# Altium schematic sheet leo_power_sch.SchDoc
size 350 x 260 mm; SheetNumber: 1; SheetTotal: 6
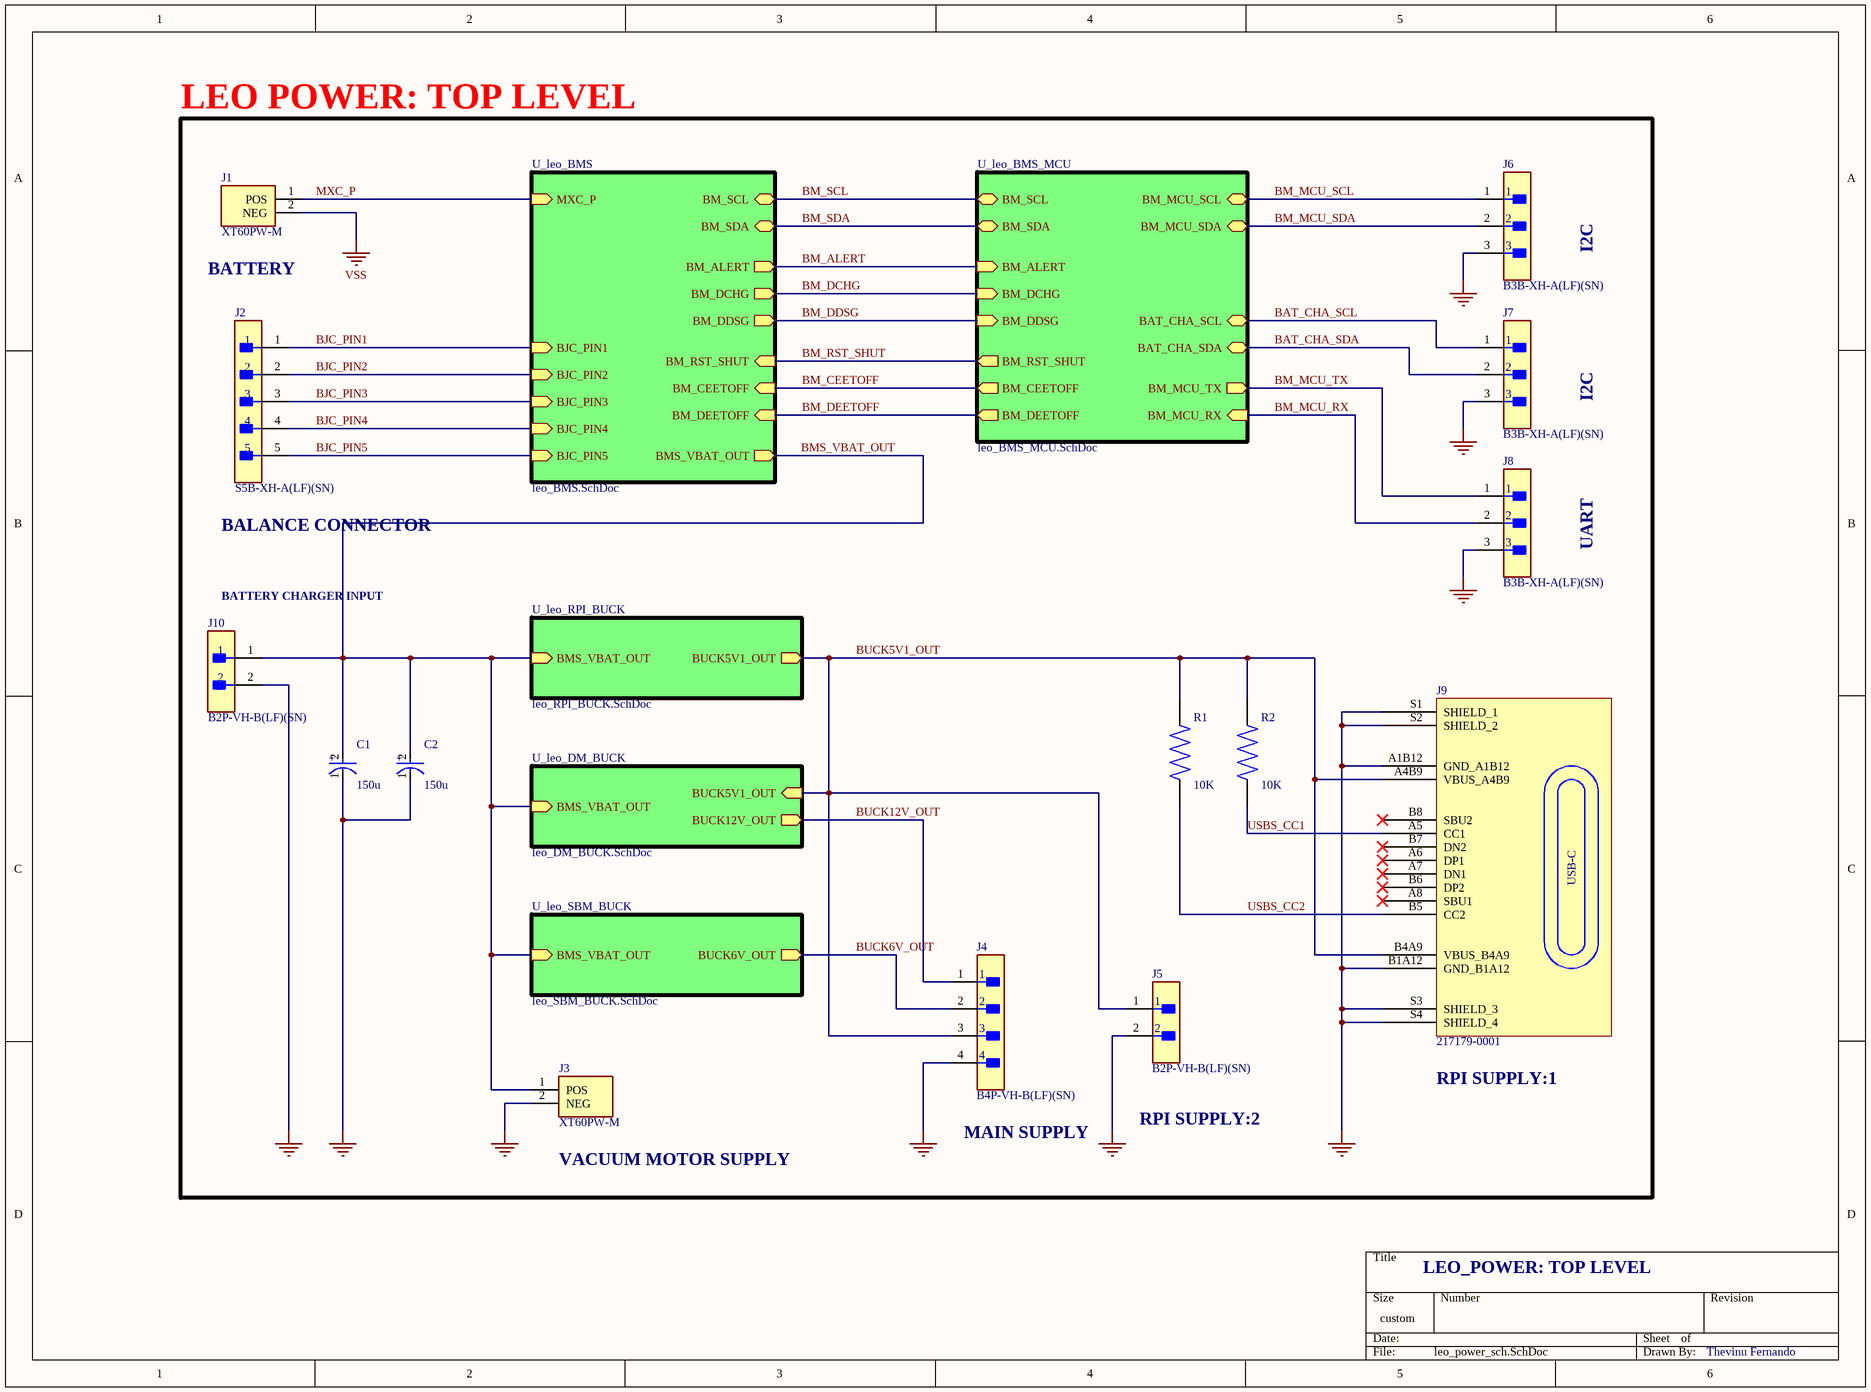
[diagram p0: leo_power_sch.SchDoc]

## Parts
C1  150u  [FP-FTD8-MFG]
C2  150u  [FP-FTD8-MFG]
J1  XT60PW-M  [AMASS_XT60PW-M]
J2  S5B-XH-A(LF)(SN)  [FP-S5B-XH-A_LF_SN-MFG]
J3  XT60PW-M  [AMASS_XT60PW-M]
J4  B4P-VH-B(LF)(SN)  [FP-B4P-VH-B_LF_SN-MFG]
J5  B2P-VH-B(LF)(SN)  [FP-B2P-VH-B_LF_SN-MFG]
J6  B3B-XH-A(LF)(SN)  [FP-B3B-XH-A_LF_SN-MFG]
J7  B3B-XH-A(LF)(SN)  [FP-B3B-XH-A_LF_SN-MFG]
J8  B3B-XH-A(LF)(SN)  [FP-B3B-XH-A_LF_SN-MFG]
J9  217179-0001  [FP-2171790001-MFG USB-C 2.0]
J10  B2P-VH-B(LF)(SN)  [FP-B2P-VH-B_LF_SN-MFG]
R1  10K  [RES_0402]
R2  10K  [RES_0402]

## Sub-sheets
U_leo_BMS = leo_BMS.SchDoc: BJC_PIN5 (in), BJC_PIN4 (in), BJC_PIN3 (in), BJC_PIN2 (in), BJC_PIN1 (in), MXC_P (in), BM_SCL (bidir), BM_SDA (bidir), BM_RST_SHUT (in), BM_CEETOFF (in), BM_DEETOFF (in), BM_ALERT (out), BM_DCHG (out), BM_DDSG (out), BMS_VBAT_OUT (out)
U_leo_BMS_MCU = leo_BMS_MCU.SchDoc: BM_SDA (bidir), BM_SCL (bidir), BM_MCU_SDA (bidir), BM_MCU_SCL (bidir), BAT_CHA_SDA (bidir), BAT_CHA_SCL (bidir), BM_RST_SHUT (out), BM_CEETOFF (out), BM_DEETOFF (out), BM_ALERT (in), BM_DCHG (in), BM_DDSG (in), BM_MCU_TX (out), BM_MCU_RX (in)
U_leo_DM_BUCK = leo_DM_BUCK.SchDoc: BMS_VBAT_OUT (in), BUCK12V_OUT (out), BUCK5V1_OUT (in)
U_leo_RPI_BUCK = leo_RPI_BUCK.SchDoc: BMS_VBAT_OUT (in), BUCK5V1_OUT (out)
U_leo_SBM_BUCK = leo_SBM_BUCK.SchDoc: BMS_VBAT_OUT (in), BUCK6V_OUT (out)

## Nets
GND: C1.1(C) C2.1(C) J3.2(NEG) J4.4 J5.2 J6.3 J7.3 J8.3 J9.A1B12(GND_A1B12) J9.B1A12(GND_B1A12) J9.S1(SHIELD_1) J9.S2(SHIELD_2) J9.S3(SHIELD_3) J9.S4(SHIELD_4) J10.2
VSS: J1.2(NEG)
BAT_CHA_SCL: J7.1 ; sheet U_leo_BMS_MCU/BAT_CHA_SCL
BAT_CHA_SDA: J7.2 ; sheet U_leo_BMS_MCU/BAT_CHA_SDA
BJC_PIN1: J2.1 ; sheet U_leo_BMS/BJC_PIN1
BJC_PIN2: J2.2 ; sheet U_leo_BMS/BJC_PIN2
BJC_PIN3: J2.3 ; sheet U_leo_BMS/BJC_PIN3
BJC_PIN4: J2.4 ; sheet U_leo_BMS/BJC_PIN4
BJC_PIN5: J2.5 ; sheet U_leo_BMS/BJC_PIN5
BM_ALERT: sheet U_leo_BMS/BM_ALERT, sheet U_leo_BMS_MCU/BM_ALERT
BM_CEETOFF: sheet U_leo_BMS/BM_CEETOFF, sheet U_leo_BMS_MCU/BM_CEETOFF
BM_DCHG: sheet U_leo_BMS/BM_DCHG, sheet U_leo_BMS_MCU/BM_DCHG
BM_DDSG: sheet U_leo_BMS/BM_DDSG, sheet U_leo_BMS_MCU/BM_DDSG
BM_DEETOFF: sheet U_leo_BMS/BM_DEETOFF, sheet U_leo_BMS_MCU/BM_DEETOFF
BM_MCU_RX: J8.2 ; sheet U_leo_BMS_MCU/BM_MCU_RX
BM_MCU_SCL: J6.1 ; sheet U_leo_BMS_MCU/BM_MCU_SCL
BM_MCU_SDA: J6.2 ; sheet U_leo_BMS_MCU/BM_MCU_SDA
BM_MCU_TX: J8.1 ; sheet U_leo_BMS_MCU/BM_MCU_TX
BM_RST_SHUT: sheet U_leo_BMS/BM_RST_SHUT, sheet U_leo_BMS_MCU/BM_RST_SHUT
BM_SCL: sheet U_leo_BMS/BM_SCL, sheet U_leo_BMS_MCU/BM_SCL
BM_SDA: sheet U_leo_BMS/BM_SDA, sheet U_leo_BMS_MCU/BM_SDA
BMS_VBAT_OUT: C1.2(A) C2.2(A) J3.1(POS) J10.1 ; sheet U_leo_BMS/BMS_VBAT_OUT, sheet U_leo_SBM_BUCK/BMS_VBAT_OUT, sheet U_leo_DM_BUCK/BMS_VBAT_OUT, sheet U_leo_RPI_BUCK/BMS_VBAT_OUT
BUCK5V1_OUT: J4.3 J5.1 J9.A4B9(VBUS_A4B9) J9.B4A9(VBUS_B4A9) R1.2 R2.2 ; sheet U_leo_DM_BUCK/BUCK5V1_OUT, sheet U_leo_RPI_BUCK/BUCK5V1_OUT
BUCK6V_OUT: J4.2 ; sheet U_leo_SBM_BUCK/BUCK6V_OUT
BUCK12V_OUT: J4.1 ; sheet U_leo_DM_BUCK/BUCK12V_OUT
MXC_P: J1.1(POS) ; sheet U_leo_BMS/MXC_P
USBS_CC1: J9.A5(CC1) R2.1
USBS_CC2: J9.B5(CC2) R1.1

Not connected (* = marked no-connect by the designer): J9 A6(DP1)* A7(DN1)* A8(SBU1)* B6(DP2)* B7(DN2)* B8(SBU2)*

## Notes on the sheet
- LEO POWER: TOP LEVEL
- I2C
- BATTERY
- BALANCE CONNECTOR
- BATTERY CHARGER INPUT
- UART
- MAIN SUPPLY
- RPI SUPPLY:2
- (near J9) RPI SUPPLY:1
- (near J3) VACUUM MOTOR SUPPLY
- LEO_POWER: TOP LEVEL
- Thevinu Fernando
- (in symbol EEEFTV151XAP) +
- (in symbol USB_Connector) USB-C

## Library data of the parts
C1 C2 = EEEFTV151XAP: CAP ALUM 150UF 20% 35V SMD; Ripple Current (AC): 600mA; Leakage Current: 52.5uA; ESR (Equivalent Series Resistance): 160mR; Life (Hours): 2000Hour; Dielectric Material: Aluminium; Lead Diameter: 0.65mm; Polarity: Polar; Number of Pins: 8; Voltage Rating (DC): 35V; Diameter: 6.3mm; Length: 7.7mm; Construction: Cylindrical; Height - Seated (Max): 0.315inch; Series: FT; Ripple Current: 600mA; Voltage Rating: 35V; Termination: SMD/SMT; Min Operating Temperature: -55°C; Packaging: Tape and Reel; REACH SVHC: No SVHC; Contact Plating: Tin; Lead Pitch: 1.8mm; Case/Package: Radial; Height: 7.7mm; Radiation Hardening: No; RoHS Compliant: Yes; Package Quantity: 900; Mount: Surface Mount; Lead Free: Lead Free; Tolerance: 20%; Max Operating Temperature: 105°C; Capacitance: 150uF; Voltage: 35V
J1 J3 = XT60PW-M: Socket, DC supply, male, PIN: 2; MF: AMASS; Check_prices: https://www.snapeda.com/parts/XT60PW-M/AMASS/view-part/?ref=eda; SnapEDA_Link: https://www.snapeda.com/parts/XT60PW-M/AMASS/view-part/?ref=snap; Price: None; Availability: Not in stock; Package: Package; MP: XT60PW-M; Value: *
J2 = S5B-XH-A(LF)(SN): CONN HEADER R/A 5POS 2.5MM; Contact Resistance: 10mR; Voltage Rating: 250V; Number of Contacts: 5; Current Rating: 3A; Insulation Resistance: 1GR; Wire/Cable Gauge: 22AWG; Number of Rows: 1; Contact Plating: Tin; Fastening Type: Detent; Contact Finish - Mating: TIN; Contact Material: Brass; Lead Free: Lead Free; Connector Type: Header; REACH SVHC: No SVHC; Insulation Color: Natural; Orientation: Right Angle; Contact Type: Male Pin; Pitch: 2.5mm; Contact Shape: Square; Series: XH; Color: Natural; Lead Pitch: 2.5mm; Mount: Through Hole; Termination: Solder; Max Operating Temperature: 85°C; Number of Positions: 5; Flammability Rating: UL94 V-0; Min Operating Temperature: -25°C; Packaging: Bulk; Voltage Rating (AC): 250V; Insulation Material: Nylon
J4 = B4P-VH-B(LF)(SN): CONN HEADER VERT 4POS 3.96MM; Number of Positions: 4; Voltage Rating: 250V; Pitch: 3.96mm; Flammability Rating: UL94 V-0; Contact Material: Brass; Insulation Color: Natural; Contact Shape: Square; Contact Finish - Mating: TIN; Termination: Solder; Number of Rows: 1; Mount: Through Hole; Fastening Type: Ramp; Packaging: Bulk; Insulation Material: PBT; Series: VH; Lead Free: Lead Free; Connector Type: Header; Contact Type: Male Pin
J5 J10 = B2P-VH-B(LF)(SN): CONN HEADER VERT 2POS 3.96MM; Number of Positions: 2; Pitch: 0.156inch; Voltage Rating: 250V; Termination: Solder; Lead Free: Lead Free; Insulation Color: Natural; Contact Material: Brass; Flammability Rating: UL94 V-0; Packaging: Bulk; Contact Mating Length: 0.303inch; Color: Natural; Contact Shape: Square; Contact Plating: Tin; Number of Rows: 1; Insulation Material: PBT; Connector Type: Header; Contact Finish - Mating: TIN; Mount: Through Hole; Fastening Type: Friction; Contact Type: Male Pin; Series: VH
J6-J8 = B3B-XH-A(LF)(SN): CONN HEADER VERT 3POS 2.5MM; Max Voltage Rating (DC): 250V; Number of Positions: 3; Current Rating: 3A; Gender: Male; Wire/Cable Gauge: 22AWG; Contact Resistance: 20mR; Insulation Resistance: 1GR; Insulation Material: Nylon; Contact Plating: Tin; Depth: 5.75mm; Contact Type: Male Pin; Max Operating Temperature: 85°C; Insulation Color: Natural; Voltage Rating (AC): 250V; Color: Natural; Connector Type: Header; Orientation: Straight; Fastening Type: Detent; Housing Color: White; Min Operating Temperature: -25°C; Termination: Solder; Voltage Rating: 250V; Series: XH; Pitch: 2.5mm; Contact Shape: Square; Number of Rows: 1; Lead Free: Lead Free; Packaging: Bulk; Mount: Through Hole; Flammability Rating: UL94 V-0; Max Voltage Rating (AC): 250V; REACH SVHC: No SVHC; Housing Material: Polyamide; Contact Material: Brass; Lead Pitch: 2.5mm; Contact Finish - Mating: TIN; Length: 9.9mm; Max Current Rating: 3A; Number of Contacts: 3
J9 = USB_Connector: USB 2.0 5A 1 16P -40℃~+85℃ SMD USB, DVI, HDMI Connector Assemblies RoHS; Manufacturer: Molex; Supplier: Digikey; Supplier Part Number: 900-2171790001CT-ND; Manufacturer Part Number: 217179-0001; RoHS: No; Category: Connectors; Stock: 7228; Pricing: 1=0.9, 10=0.745, 100=0.6212 (USD); LCSC Part Number: C3197684
R1 R2 = RES_0402: Chip Resistor 0402 (1005 Metric) Automotive AEC-Q200 Thick Film; MF: Panasonic; MP: ERJ-2RKF1002X; Package: 1005-2 Panasonic; Price: None; Check_prices: https://www.snapeda.com/parts/ERJ-2RKF1002X/Panasonic%20Electronic%20Components/view-part/78636/?ref=eda; Value: *; SnapEDA_Link: https://www.snapeda.com/parts/ERJ-2RKF1002X/Panasonic%20Electronic%20Components/view-part/78636/?ref=snap; Availability: In Stock